# Altium schematic sheet RFID_240713 V3.01.SchDoc
size A3
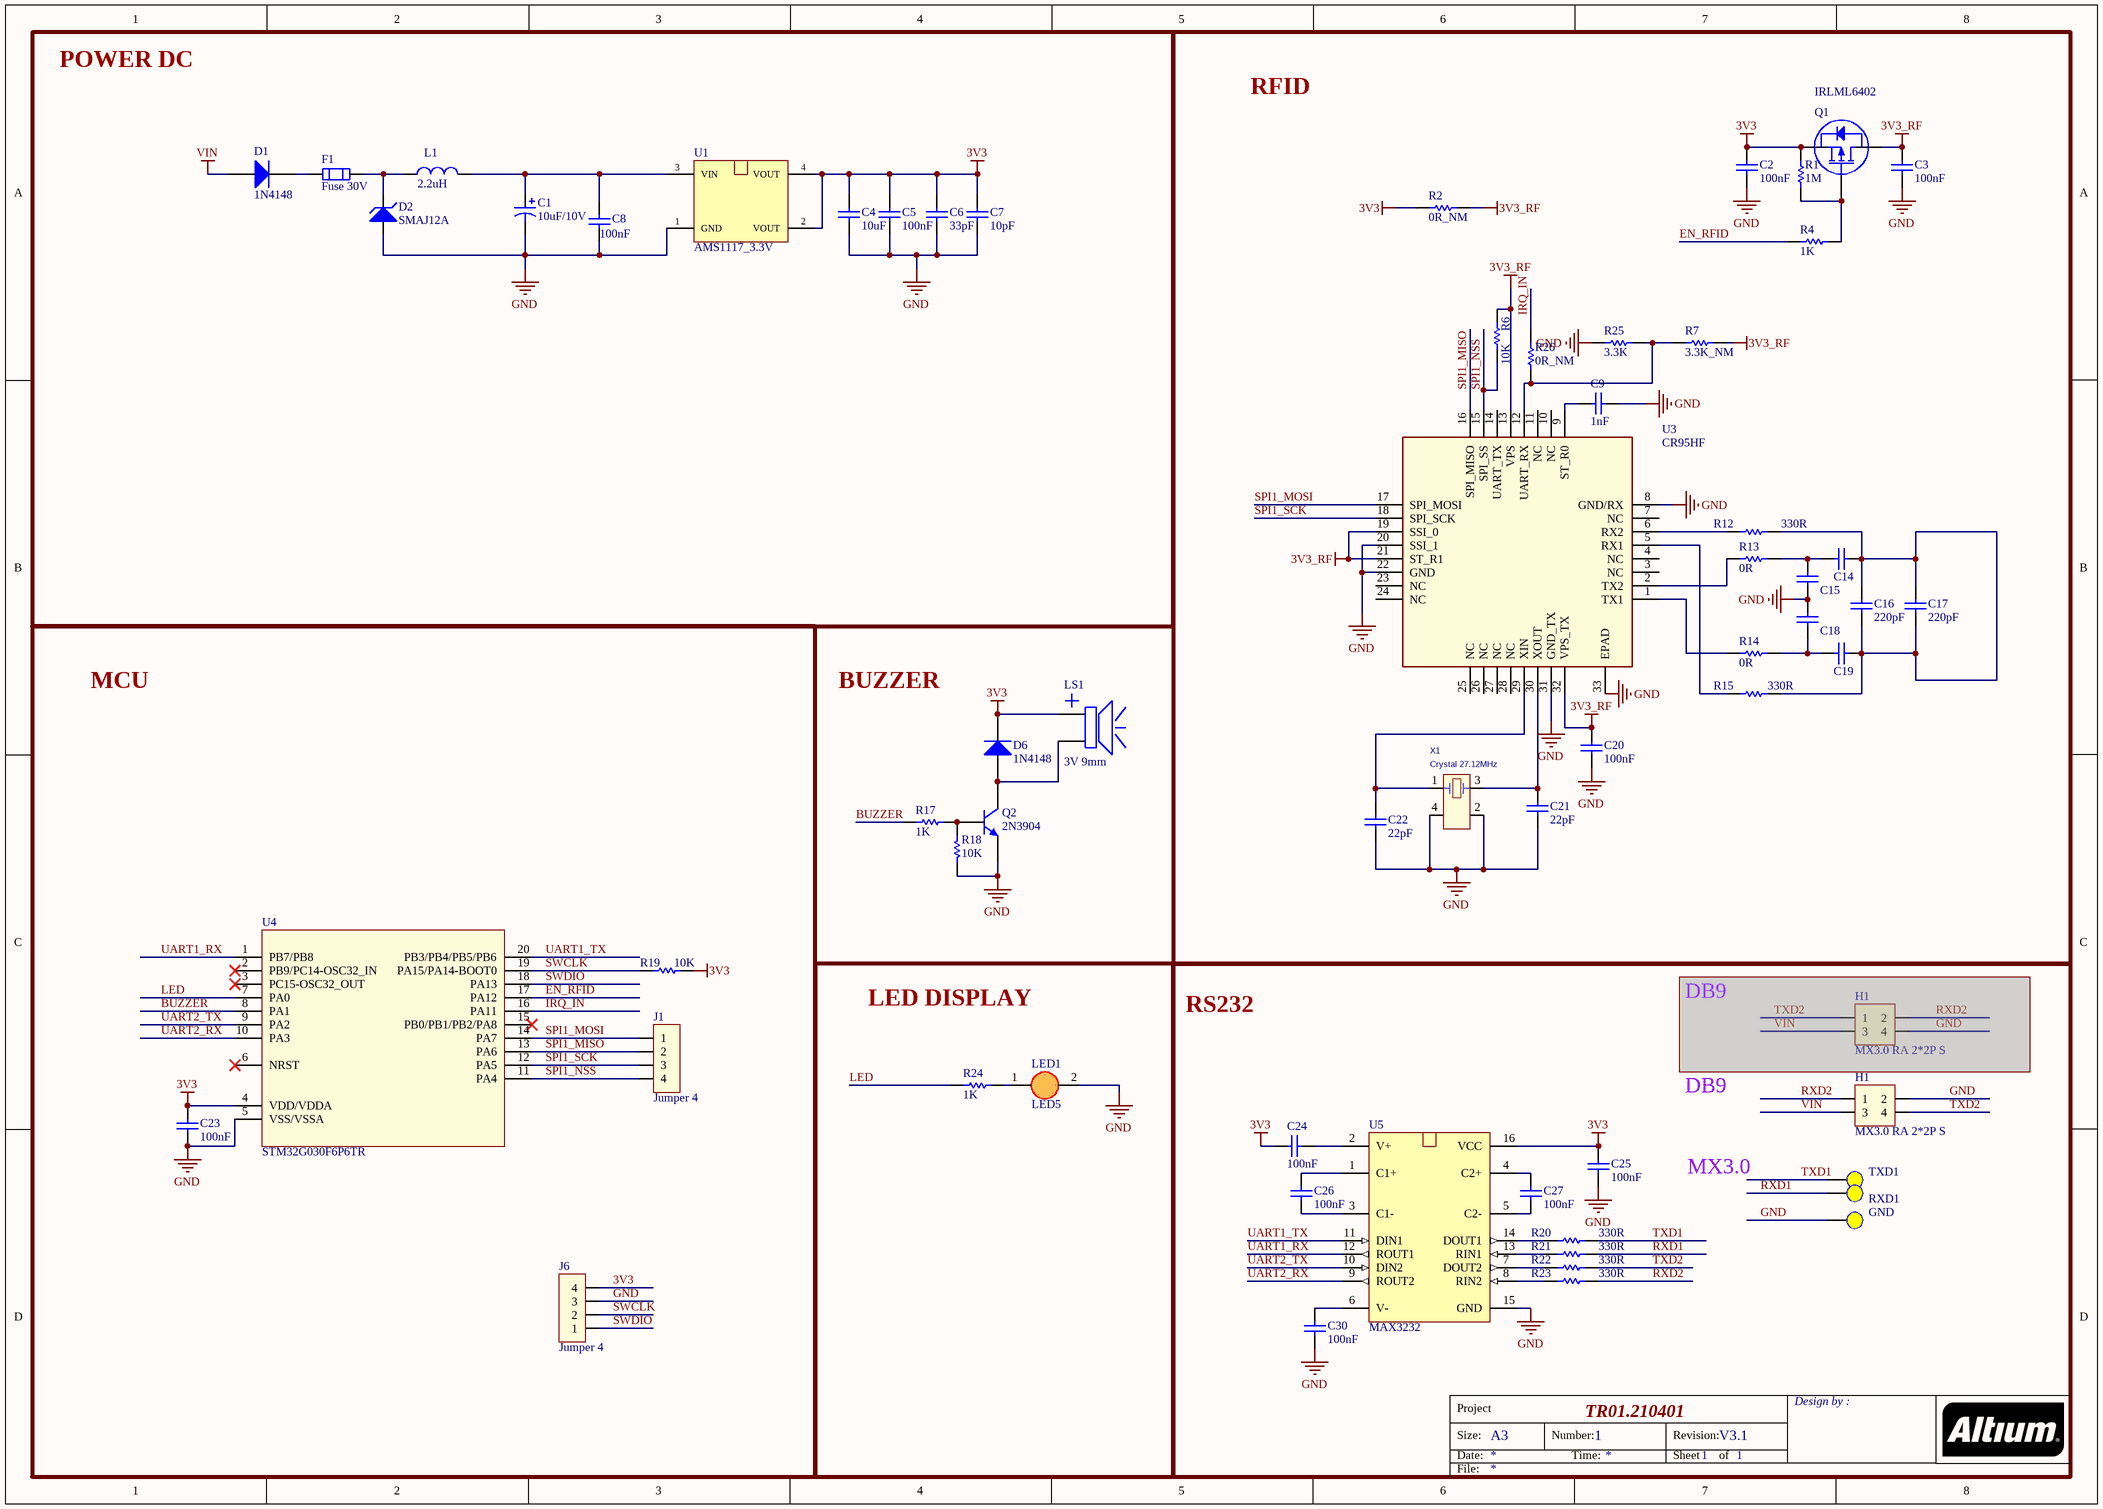
[diagram p0: RFID_240713 V3.01.SchDoc]

## Parts
(Parts that share a designator on the sheet are numbered #1, #2 ... from top to bottom, then left to right.)
C1  value 10uF/10V  [3216 - TANTALUM]  (hidden comment: 10uF/16V)
C2  100nF  [0603 - C]
C3  100nF  [0603 - C]
C4  10uF  [0603 - C]
C5  100nF  [0603 - C]
C6  33pF  [0603 - C]
C7  10pF  [0603 - C]
C8  100nF  [0603 - C]
C9  1nF  [0603 - C]
C14  150pF  [0603 - C]  (value not drawn)
C15  150pF  [0603 - C]  (value not drawn)
C16  220pF  [0603 - C]
C17  220pF  [0603 - C]
C18  150pF  [0603 - C]  (value not drawn)
C19  150pF  [0603 - C]  (value not drawn)
C20  100nF  [0603 - C]
C21  22pF  [0603 - C]
C22  22pF  [0603 - C]
C23  100nF  [0603 - C]
C24  100nF  [0603 - C]
C25  100nF  [0603 - C]
C26  100nF  [0603 - C]
C27  100nF  [0603 - C]
C30  100nF  [0603 - C]
D1  1N4148  [SOD-123]
D2  SMAJ12A  [Diode - SMA]
D6  1N4148  [SOD-123]
F1  Fuse 30V  [1206 - Fuse]
GND  Test Point  [TP1]  (value not drawn)
H1#1  MX3.0 RA 2*2P S  [43045-M3045-2x2-B]  (masked out: inside a compile mask, not in the netlist)
H1#2  MX3.0 RA 2*2P S  [43045-M3045-2x2-B]
J1  Jumper 4  [JP4]
J6  Jumper 4  [JP4]
L1  2.2uH  [1210 - L]
LED1  LED5  [LED VUONG 5MM]
LS1  3V 9mm  [Buzzer]
Q1  IRLML6402  [SOT23B]
Q2  2N3904  [SOT23B]
R1  1M  [0603 - R]
R2  0R_NM  [0603 - R]
R4  1K  [0603 - R]
R6  10K  [0603 - R]
R7  3.3K_NM  [0603 - R]
R12  330R  [0603 - R]
R13  0R  [0603 - R]
R14  0R  [0603 - R]
R15  330R  [0603 - R]
R17  1K  [0603 - R]
R18  10K  [0603 - R]
R19  10K  [0603 - R]
R20  330R  [0603 - R]
R21  330R  [0603 - R]
R22  330R  [0603 - R]
R23  330R  [0603 - R]
R24  1K  [0603 - R]
R25  3.3K  [0603 - R]
R26  0R_NM  [0603 - R]
RXD1  Test Point  [TP1]  (value not drawn)
TXD1  Test Point  [TP1]  (value not drawn)
U1  AMS1117_3.3V  [SOT223]
U3  CR95HF  [32-VFQFN]
U4  STM32G030F6P6TR  [TSSOP20]
U5  MAX3232  [SOIC16]
X1  Crystal 27.12MHz  [Crystal 2016]

## Blocks framed on the sheet
POWER DC: C1 C4-C8 D1 D2 F1 L1 U1
RFID: C2 C3 C9 C14-C22 Q1 R1 R2 R4 R6 R7 R12-R15 R25 R26 U3 X1
MCU: C23 J1 J6 R19 U4
LED DISPLAY: LED1 R24
RS232: C24-C27 C30 GND H1#1 H1#2 R20-R23 RXD1 TXD1 U5

## Nets
3V3: C2.2 C4.2 C5.2 C6.2 C7.2 C23.2 C24.2 C25.2 D6.2(K) J6.4 LS1.1 Q1.2(S) R1.2 R2.1 R19.2 U1.2(VOUT) U1.4(VOUT) U4.4(VDD/VDDA) U5.16(VCC)
3V3_RF: C3.2 C20.2 Q1.3(D) R2.2 R6.2 R7.1 U3.13(VPS) U3.19(SSI_0) U3.21(ST_R1) U3.32(VPS_TX)
GND: C1.2 C2.1 C3.1 C4.1 C5.1 C6.1 C7.1 C8.1 C9.2 C15.1 C18.2 C20.1 C21.1 C22.1 C23.1 C25.1 C30.1 D2.1(A) GND.1 H1#2.2 J6.3 LED1.2(K) Q2.2(E) R18.1 R25.2 U1.1(GND) U3.8(GND/RX) U3.20(SSI_1) U3.22(GND) U3.31(GND_TX) U3.33(EPAD) U4.5(VSS/VSSA) U5.15(GND) X1.2(GND) X1.4(GND)
VIN: D1.1(A) H1#2.3
BUZZER: R17.1 U4.8(PA1)
EN_RFID: R4.1 U4.17(PA12)
IRQ_IN: R26.2 U4.16(PA11)
LED: R24.1 U4.7(PA0)
RXD1: R21.2 RXD1.1
RXD2: H1#2.1 R23.2
SPI1_MISO: J1.2 U3.16(SPI_MISO) U4.13(PA6)
SPI1_MOSI: J1.1 U3.17(SPI_MOSI) U4.14(PA7)
SPI1_NSS: J1.4 R6.1 U3.15(SPI_SS) U4.11(PA4)
SPI1_SCK: J1.3 U3.18(SPI_SCK) U4.12(PA5)
SWCLK: J6.2 R19.1 U4.19(PA15/PA14-BOOT0)
SWDIO: J6.1 U4.18(PA13)
TXD1: R20.2 TXD1.1
TXD2: H1#2.4 R22.2
UART1_RX: U4.1(PB7/PB8) U5.12(ROUT1)
UART1_TX: U4.20(PB3/PB4/PB5/PB6) U5.11(DIN1)
UART2_RX: U4.10(PA3) U5.9(ROUT2)
UART2_TX: U4.9(PA2) U5.10(DIN2)
NetC1_1: C1.1 C8.2 L1.2 U1.3(VIN)
NetC9_1: C9.1 U3.9(ST_R0)
NetC14_1: C14.1 C15.2 R13.2
NetC14_2: C14.2 C16.1 C16.2 C17.1 C17.2 C19.2 R12.2 R15.2
NetC18_1: C18.1 C19.1 R14.2
NetC21_2: C21.2 U3.30(XOUT) X1.3(OSC2)
NetC22_2: C22.2 U3.29(XIN) X1.1(OSC1)
NetC24_1: C24.1 U5.2(V+)
NetC26_1: C26.1 U5.3(C1-)
NetC26_2: C26.2 U5.1(C1+)
NetC27_1: C27.1 U5.5(C2-)
NetC27_2: C27.2 U5.4(C2+)
NetC30_2: C30.2 U5.6(V-)
NetD1_2: D1.2(K) F1.1
NetD2_2: D2.2(K) F1.2 L1.1
NetD6_1: D6.1(A) LS1.2 Q2.3(C)
NetLED1_1: LED1.1(A) R24.2
NetQ1_1: Q1.1(G) R1.1 R4.2
NetQ2_1: Q2.1(B) R17.2 R18.2
NetR7_2: R7.2 R25.1 R26.1 U3.12(UART_RX)
NetR12_1: R12.1 U3.6(RX2)
NetR13_1: R13.1 U3.2(TX2)
NetR14_1: R14.1 U3.1(TX1)
NetR15_1: R15.1 U3.5(RX1)
NetR20_1: R20.1 U5.14(DOUT1)
NetR21_1: R21.1 U5.13(RIN1)
NetR22_1: R22.1 U5.7(DOUT2)
NetR23_1: R23.1 U5.8(RIN2)

Not connected (* = marked no-connect by the designer): U3 3(NC) 4(NC) 7(NC) 10(NC) 11(NC) 14(UART_TX) 23(NC) 24(NC) 25(NC) 26(NC) 27(NC) 28(NC); U4 2(PB9/PC14-OSC32_IN)* 3(PC15-OSC32_OUT)* 6(NRST)* 15(PB0/PB1/PB2/PA8)*

## Notes on the sheet
- BUZZER
- DB9
- MX3.0
- Project
- Size:
- Date:
- A3
- Number:
- Time:
- TR01.210401
- 1
- Revision:
- Sheet
- V3.1
- of
- Design by :
- File:

## Library data of the parts
C1 = Cap Tan 3216 10uF: CAP TANT 10UF 10V 10% 1206; MPN: TAJA106K016RNJ; MFR: AVX; Comnpany ID: VT_CAP TAN 10uF 10V
C2 C3 C20 C23 = Cap 0603 100nF: CAP CER 100nF 50V C0G/NP0 0603; MPN: CL10C104JB8NNNC; MFR: SAMSUNG; Company ID: VT_CAP_C0603 100nF; Voltage: 50V; Package: 0603; Size: C0603: 100nF; Value: 100nF
C4 = Cap 0603 10uF: CAP CER 10UF 16V X5R 0603; MPN: EMK107BBJ106MA-T; MFR: Yageo; Company ID: VT_CAP_C0603 10uF; Size: C0603: 10uF; Package: 0603; Value: 10uF
C5 C8 C24-C27 C30 = Cap 0603 100nF: CAP CER 100nF 50V C0G/NP0 0603; MPN: CL10C104JB8NNNC; MFR: SAMSUNG; Company ID: VT_TỤ ĐIỆN_C0603 100nF; Voltage: 50V; Package: 0603; Size: C0603: 100nF; Value: 100nF
C6 = Cap 0603 33pF: CAP CER 33PF 50V C0G 0603; MFR: Yageo; MPN: AC0603FRNPO9BN330; Company ID: VT_CAP_C0603 33pF; Size: C0603: 33pF; Value: 33pF
C7 = Cap 0603 10pF: CAP CER 10PF 50V C0G/NP0 0603; MPN: CL10C100JB8NNNC; MFR: SAMSUNG; Company ID: VT_CAP_C0603 10pF; Size: C0603: 10pF; Value: 10pF
C9 = Cap 0603 1nF: CAP CER 1000PF 50V C0G/NP0 0603; MPN: CL10C102JB8NNNC; MFR: SAMSUNG; Company ID: VT_TỤ ĐIỆN_C0603 1nF; Size: C0603: 1nF; Value: 1nF
C14 C15 C18 C19 = Cap 0603 150pF: CAP CER 150PF 50V C0G/NP0 0603; MPN: CL10C151JB8NNNC; MFR: SAMSUNG; Company ID: VT_TỤ ĐIỆN_C0603 150pF; Value: 150pF; Size: C0603: 150pF
C16 C17 = Cap 0603 220pF: CAP CER 220PF 50V C0G/NP0 0603; MPN: CL10C221JB8NNNC; MFR: SAMSUNG; Company ID: VT_TỤ ĐIỆN_C0603 220pF; Value: 220pF; Size: C0603: 220pF
C21 C22 = Cap 0603 22pF: CAP CER 22PF 50V C0G/NP0 0603; MPN: CL10C220JB8NNNC; MFR: SAMSUNG; Company ID: VT_TỤ ĐIỆN_C0603 22pF; Value: 22pF; Size: C0603: 22pF
D1 D6 = Diode 1N4148: DIODE GEN PURP 100V 300MA SOD123; MPN: 1N4148W-7-F; MFR: DIODES; Company ID: VT_DIODE_1N4148W-7-F
D2 = Diode SMAJ5.0A: TVS DIODE 12VWM 9.2VC SMA; MFR: Littelfuse Inc.; Company ID: VT_DIODE_ SMAJ5.0A; MPN: SMAJ12A
F1 = Fuse 30V - 0.125A: PTC RESET FUSE 30V 0.125A 1206; MFR: BrightKing; MPN: SMD1206B012TF; Company ID: VT_Fuse_30V - 0.125A
GND RXD1 TXD1 = TP: 1mm - 1 layer
H1#1 H1#2 = HD2x2 S: Micro-Fit 3.0™ Straight Header, 3.00mm Pitch, Dual Row, 4 Circuits; MPN: M3045-2x2-B; MFR: China; Company ID: VT_CONN_2*2 (M3045); MPN2: 43045-
J1 J6 = JP4: Jumper 4, 2.54mmx4
L1 = Inductor 3225 2.2uH: FIXED IND 2.2UH 1.6A 76 MOHM SMD; MPN: LQH32PN2R2NN0; MFR: Murata; Company ID: VT_IND_3225 2.2uH; Value: 2.2uH; Size: L3225: 2.2uH; MPN2: SWPA3015S2R2NT
LED1 = LED 5mm
LS1 = Speaker: Buzzer 9*6mm (D*h); MFR: China; MPN: TMB09A03; Company ID: VT_Buzzer 3V 9mm
Q1 = IRLML6402TRPBF: MOSFET P-CH 30V 3.6A SOT-23-3; MFR: Infineon Technologies; Categories: TRANSISTOR; MPN: IRLML6402TRPBF
Q2 = Transistor 2N3904: TRANS NPN 40V 0.2A SOT-23; MPN: MMBT3904; MFR: Fairchild; Company ID: VT_TRANSISTOR_3904
R1 = Res 0603 1M: RES SMD 1M OHM 1% 1/10W 0603; MFR: Yageo; MPN: RC0603FR-071ML; Company ID: VT_RES_R0603 1M; Value: 1M
R2 R13 R14 R26 = Res 0603 0R: RES SMD 0 OHM JUMPER 1/10W 0603; MFR: Yageo; MPN: RC0603FR-070RL; Company ID: VT_ĐIỆN TRỞ_R0603 0R; Size: R0603: 0R
  R2 R26: Value: 0R_NM
  R13 R14: Value: 0R
R4 R17 R24 = Res 0603 1K: RES SMD 1K OHM 1% 1/10W 0603; MFR: Yageo; MPN: RC0603FR-071KL; Company ID: VT_ĐIỆN TRỞ_R0603 1K; Size: R0603: 1K; Value: 1K
R6 R19 = Res 0603 10K: RES SMD 10K OHM 1% 1/10W 0603; MFR: Yageo; MPN: RC0603FR-0710KL; Company ID: VT_ĐIỆN TRỞ_R0603 10K; Size: R0603: 10K; Value: 10K
R7 R25 = Res 0603 3.3K: RES SMD 3.3K OHM 1% 1/10W 0603; MFR: Yageo; MPN: RC0603FR-073K3L; Company ID: VT_ĐIỆN TRỞ_R0603 3.3K; Size: R0603: 3.3K
  R7: Value: 3.3K_NM
  R25: Value: 3.3K
R12 R15 R20-R23 = Res 0603 330R: RES SMD 330OHM 1% 1/10W 0603; MFR: Yageo; MPN: RC0603FR-07330RL; Company ID: VT_ĐIỆN TRỞ_R0603 330R; Value: 330R; Size: R0603: 330R
R18 = Res 0603 10K: RES SMD 10K OHM 1% 1/10W 0603; MFR: Yageo; MPN: RC0603FR-0710KL; Company ID: VT_RES_R0603 10K; Size: R0603: 10K; Value: 10K
U1 = AMS1117: 1A LOW DROPOUT VOLTAGE REGULATOR; MFR: TI; MPN: AMS1117 3.3; Company ID: VT_IC_AMS1117
U3 = CR95HF: IC RFID RDR/TRN 13.56MZ 32VFQFPN; MPN: CR95HF-VMD5T; MFR: ST; Company ID: VT_IC_CR95HF
U4 = STM32G030F6P6TR: IC MCU 32BIT 32KB FLASH 20TSSOP; MPN: STMicroelectronics; Company ID: VT_IC_STM32G030F6P6TR; MFR: STM32G030F6P6TR
U5 = MAX3232: 2/2 Transceiver Full RS232 16-SOIC; MPN: MAX3232EIDR; MFR: TI; Company ID: VT_IC_MAX3232
X1 = XTAL-XRCBG27M: CRYSTAL 27.12MHz RoHS; MPN: XRCGB27M120F3M00R0; MFR: Murata; Company ID: VT_CRYSTAL_SMD 27.12MHz